# EAGLE design ftdi_adapter (EAGLE 7.1.0)
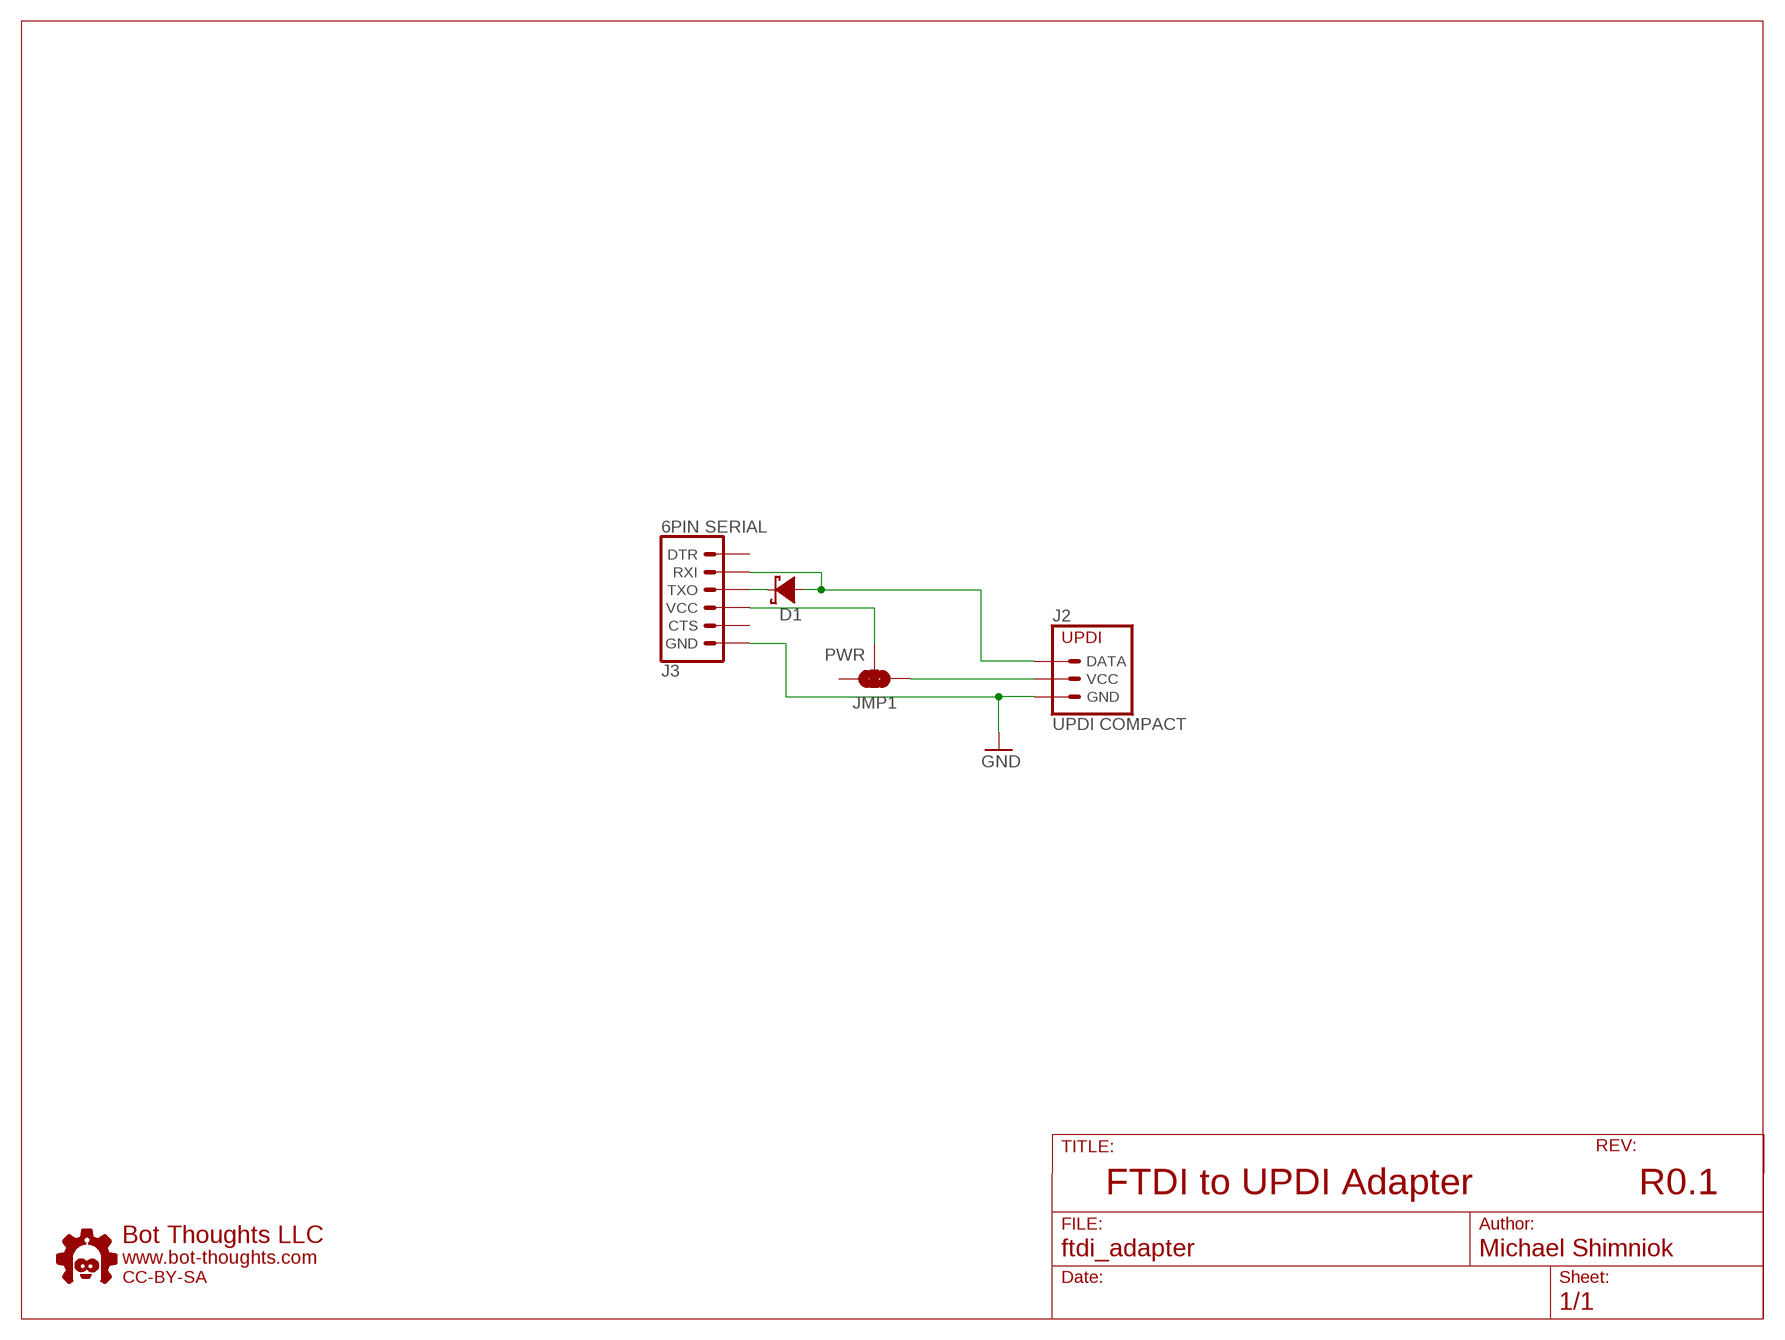
[diagram p0: schematic, sheet 1]

## Parts
D1  DIODE-SCHOTTKYSOD-323ORIG  [SOD-323ORIG]
J2  UPDI COMPACT  UPDI_COMPACT  [UPDI_1X3]
J3  6PIN SERIAL  6PIN_TARGET_LEFT  [6PIN_TARGET]
JMP1  PWR  JUMPER-2-WAY-PTH-0.1IN  [JUMPER-2W-PIN-0.1IN]
U$1  BTLOGO-LOGO-SM  [BTLOGOS]

## Nets
DATA: D1.A J2.3(DATA) J3.2(RXI)
GND: J2.2(GND) J3.6(GND)
N$1: D1.C J3.3(TXO)
N$2: J3.4(VCC) JMP1.2
VCC: J2.1(VCC) JMP1.1
Unconnected: J3.1(DTR) J3.5(CTS) JMP1.3

## Notes on the sheet
- FTDI to UPDI Adapter | R0.1

## Library data of the parts
D1 = ads4:DIODE-SCHOTTKY: Schottky Diode
J2 = bt_avr:UPDI: AVR UPDI - Unified Program and Debug Interface UPDI is a Microchip proprietary interface for external programming and on-chip debugging of a device. It is a successor to the PDI two-wire physical interface, which is found on all AVR XMEGA devices. UPDI is a one-wire interface providing a bidirectional half-duplex asynchronous communication with the target device for purposes of programming and debugging. UPDI Physical Interface <https://onlinedocs.microchip.com/pr/GUID-DDB0017E-84E3-4E77-AAE9-7AC4290E5E8B-en-US-4/index.html?GUID-9B349315-2842-4189-B88C-49F4E1055D7F>
J3 = bt_communication:6PIN_TARGET: 6-Pin Serial Target Connector For serial programming of Arduino, serial comms, etc., using FTDI, PL2303.
JMP1 = bt:JUMPER-2-WAY: 2-Way Jumper
U$1 = bt:BTLOGO: Bot Thoughts Logo

## Board
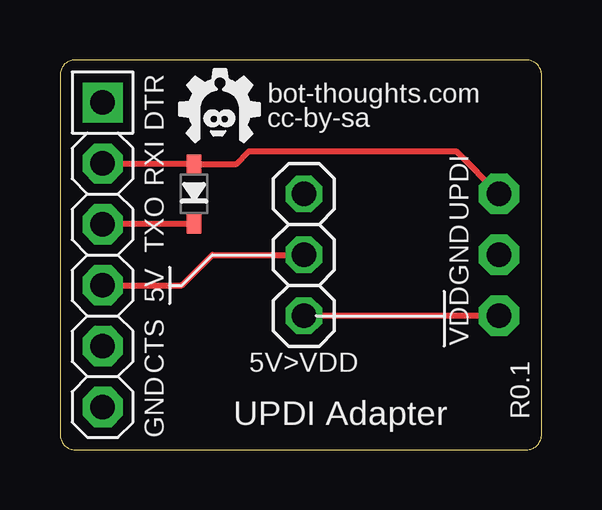
[diagram p1: board, top side]
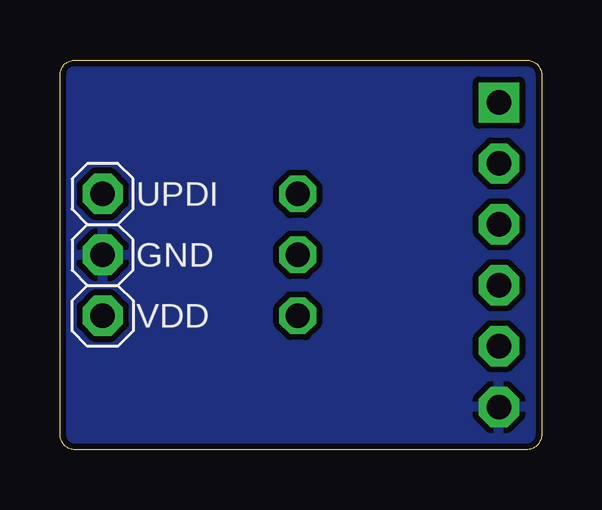
[diagram p2: board, bottom side, seen from below]

Size 20.07 x 16.26 mm. Coordinates in mm from the lower left corner, seen from the top.
Outline: 0,15.62 0,0.64 arc90 0.64,0 19.43,0 arc90 20.07,0.64 20.07,15.62 arc90 19.43,16.26 0.64,16.26 arc90 0,15.62
Copper layers (1*16): Top 0.0356mm / dielectric 1.5011mm / Bottom 0.0356mm
Design rules "LaenPCBOrder": minimum track width 6mil, minimum drill 13mil, track to track 10mil, track to pad 10mil, pad to pad 10mil, via to via 10mil, smd to smd 8mil, copper to edge 10mil, drill to drill 10mil, minimum pad ring 7mil, minimum via ring 7mil, stop-mask expansion 3mil, vias tented up to drill 20mil, thermal gap 10mil

### Footprints (pad centres in the part's own frame; a part is rotated, then mirrored left to right if it is on the bottom)
SOD-323ORIG = smd 0.8 x 0.6: A 1.25,0; C -1.25,0
UPDI_1X3 = drill 1.016 pad 1.676 octagon: 1 0,2.54; 2 0,0; 3 0,-2.54
6PIN_TARGET = drill 1.016 pad 1.676 square: 1 0,6.35 | drill 1.016 pad 1.676 octagon: 2 0,3.81; 3 0,1.27; 4 0,-1.27; 5 0,-3.81; 6 0,-6.35
JUMPER-2W-PIN-0.1IN = drill 1.016 octagon: 1 -2.54,0; 2 0,0; 3 2.54,0

### Placement (x,y rotation side)
D1  5.59,10.67 90 top
J2  18.29,8.13 180 bottom
J3  1.78,8.13 0 top
JMP1  10.16,8.13 90 top
U$1  6.6,12.7 0 top

### Tracks (layer width: path | path; a pad name or v marks a point on that pad's centre or on a via)
DATA
  Top 0.254: J3.2 1.78,11.92 D1.A 7.35,11.92 7.87,12.45 16.51,12.45 J2.3
GND
  pour Bottom: 0.64,16.26 19.43,16.26 arc-90 20.07,15.62 20.07,0.64 arc-90 19.43,0 0.64,0 arc-90 0,0.64 0,15.62 arc-90
N$1
  Top 0.254: D1.C 1.78,9.42 J3.3
N$2
  Top 0.254: J3.4 5.08,6.86 6.35,8.13 JMP1.2
VCC
  Top 0.254: J2.1 JMP1.1

### Text on the board
tNames: bot-thoughts.com | cc-by-sa | UPDI | GND | VDD | 5V>VDD | UPDI Adapter | R0.1